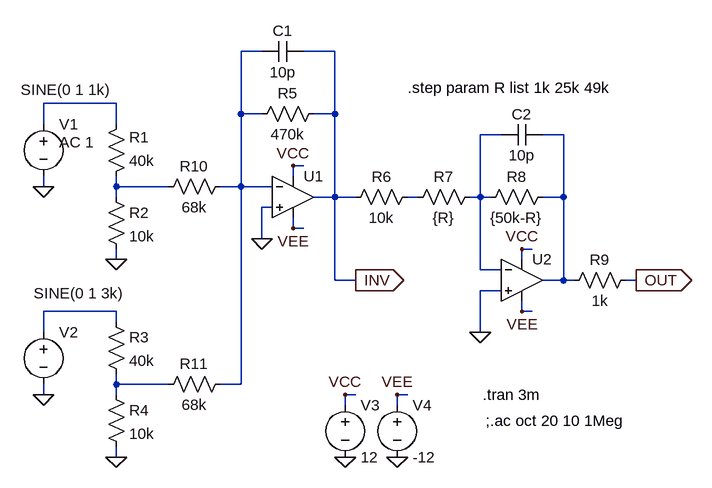
[diagram p0: schematic MIX04.asc]
MIX04.asc, the LTspice schematic file:
Version 4
SHEET 1 880 680
WIRE 96 -128 64 -128
WIRE 208 -128 160 -128
WIRE -128 -48 -240 -48
WIRE 64 -32 64 -128
WIRE 96 -32 64 -32
WIRE 208 -32 208 -128
WIRE 208 -32 176 -32
WIRE -240 -16 -240 -48
WIRE -128 -16 -128 -48
WIRE 464 0 432 0
WIRE 560 0 528 0
WIRE 160 48 144 48
WIRE 144 64 144 48
WIRE -240 80 -240 64
WIRE -128 80 -128 64
WIRE -48 80 -128 80
WIRE 64 80 64 -32
WIRE 64 80 32 80
WIRE 112 80 64 80
WIRE -128 96 -128 80
WIRE 208 96 208 -32
WIRE 208 96 176 96
WIRE 240 96 208 96
WIRE 336 96 320 96
WIRE 432 96 432 0
WIRE 432 96 416 96
WIRE 448 96 432 96
WIRE 560 96 560 0
WIRE 560 96 528 96
WIRE 112 112 96 112
WIRE 144 144 144 128
WIRE 160 144 144 144
WIRE 96 160 96 112
WIRE 512 176 496 176
WIRE -128 192 -128 176
WIRE 496 192 496 176
WIRE 432 208 432 96
WIRE 464 208 432 208
WIRE 208 224 208 96
WIRE 240 224 208 224
WIRE 560 224 560 96
WIRE 560 224 528 224
WIRE 576 224 560 224
WIRE 672 224 656 224
WIRE 464 240 432 240
WIRE -128 272 -240 272
WIRE 496 272 496 256
WIRE 512 272 496 272
WIRE -128 288 -128 272
WIRE -240 304 -240 272
WIRE 432 304 432 240
WIRE -128 384 -128 368
WIRE -48 384 -128 384
WIRE 64 384 64 80
WIRE 64 384 32 384
WIRE -240 400 -240 384
WIRE -128 400 -128 384
WIRE 240 400 224 400
WIRE 320 400 304 400
WIRE 224 416 224 400
WIRE 304 416 304 400
WIRE -128 496 -128 480
FLAG -128 192 0
FLAG -128 496 0
FLAG -240 80 0
FLAG -240 400 0
FLAG 96 160 0
FLAG 144 48 VCC
FLAG 144 144 VEE
FLAG 496 176 VCC
FLAG 496 272 VEE
FLAG 432 304 0
FLAG 672 224 OUT
IOPIN 672 224 Out
FLAG 224 400 VCC
FLAG 304 400 VEE
FLAG 224 496 0
FLAG 304 496 0
FLAG 240 224 INV
IOPIN 240 224 Out
SYMBOL Opamps\\UniversalOpamp2 144 96 R0
SYMATTR InstName U1
SYMBOL Opamps\\UniversalOpamp2 496 224 R0
SYMATTR InstName U2
SYMBOL res -144 80 M180
WINDOW 0 36 76 Left 2
WINDOW 3 36 40 Left 2
SYMATTR InstName R1
SYMATTR Value 40k
SYMBOL res -144 80 R0
SYMATTR InstName R2
SYMATTR Value 10k
SYMBOL res -144 272 R0
SYMATTR InstName R3
SYMATTR Value 40k
SYMBOL res -144 384 R0
SYMATTR InstName R4
SYMATTR Value 10k
SYMBOL voltage -240 -32 R0
WINDOW 3 -35 -37 Left 2
WINDOW 123 24 44 Left 2
WINDOW 39 0 0 Left 0
SYMATTR InstName V1
SYMATTR Value SINE(0 1 1k)
SYMATTR Value2 AC 1
SYMBOL voltage -240 288 R0
WINDOW 3 -15 -44 Left 2
WINDOW 123 0 0 Left 0
WINDOW 39 0 0 Left 0
SYMATTR InstName V2
SYMATTR Value SINE(0 1 3k)
SYMBOL res 192 -48 R90
WINDOW 0 0 56 VBottom 2
WINDOW 3 32 56 VTop 2
SYMATTR InstName R5
SYMATTR Value 470k
SYMBOL res 336 80 R90
WINDOW 0 0 56 VBottom 2
WINDOW 3 32 56 VTop 2
SYMATTR InstName R6
SYMATTR Value 10k
SYMBOL res 432 80 R90
WINDOW 0 0 56 VBottom 2
WINDOW 3 32 56 VTop 2
SYMATTR InstName R7
SYMATTR Value {R}
SYMBOL res 544 80 R90
WINDOW 0 0 56 VBottom 2
WINDOW 3 32 56 VTop 2
SYMATTR InstName R8
SYMATTR Value {50k-R}
SYMBOL res 672 208 R90
WINDOW 0 0 56 VBottom 2
WINDOW 3 32 56 VTop 2
SYMATTR InstName R9
SYMATTR Value 1k
SYMBOL voltage 224 400 R0
WINDOW 123 0 0 Left 0
WINDOW 39 0 0 Left 0
SYMATTR InstName V3
SYMATTR Value 12
SYMBOL voltage 304 400 R0
WINDOW 123 0 0 Left 0
WINDOW 39 0 0 Left 0
SYMATTR InstName V4
SYMATTR Value -12
SYMBOL res 48 64 R90
WINDOW 0 0 56 VBottom 2
WINDOW 3 32 56 VTop 2
SYMATTR InstName R10
SYMATTR Value 68k
SYMBOL res 48 368 R90
WINDOW 0 0 56 VBottom 2
WINDOW 3 32 56 VTop 2
SYMATTR InstName R11
SYMATTR Value 68k
SYMBOL cap 160 -144 R90
WINDOW 0 0 32 VBottom 2
WINDOW 3 32 32 VTop 2
SYMATTR InstName C1
SYMATTR Value 10p
SYMBOL cap 528 -16 R90
WINDOW 0 0 32 VBottom 2
WINDOW 3 32 32 VTop 2
SYMATTR InstName C2
SYMATTR Value 10p
TEXT 320 -72 Left 2 !.step param R list 1k 25k 49k
TEXT 436 400 Left 2 !.tran 3m
TEXT 440 440 Left 2 !;.ac oct 20 10 1Meg

The netlist it stands for:
* MIX04.asc
XU1 0 N001 VCC VEE INV level.2 Avol=1Meg GBW=10Meg Slew=10Meg ilimit=25m rail=0 Vos=0 phimargin=45 en=0 enk=0 in=0 ink=0 Rin=500Meg  ; pins IN+ IN- V+ V- OUT
XU2 0 N003 VCC VEE N004 level.2 Avol=1Meg GBW=10Meg Slew=10Meg ilimit=25m rail=0 Vos=0 phimargin=45 en=0 enk=0 in=0 ink=0 Rin=500Meg  ; pins IN+ IN- V+ V- OUT
R1 N005 N002 40k
R2 N005 0 10k
R3 N007 N008 40k
R4 N008 0 10k
V1 N002 0 SINE(0 1 1k) AC 1
V2 N007 0 SINE(0 1 3k)
R5 INV N001 470k
R6 N006 INV 10k
R7 N003 N006 {R}
R8 N004 N003 {50k-R}
R9 OUT N004 1k
V3 VCC 0 12
V4 VEE 0 -12
R10 N001 N005 68k
R11 N001 N008 68k
C1 INV N001 10p
C2 N004 N003 10p
.step param R list 1k 25k 49k
.tran 3m
;.ac oct 20 10 1Meg
.lib UniversalOpamps2.sub
.backanno
.end